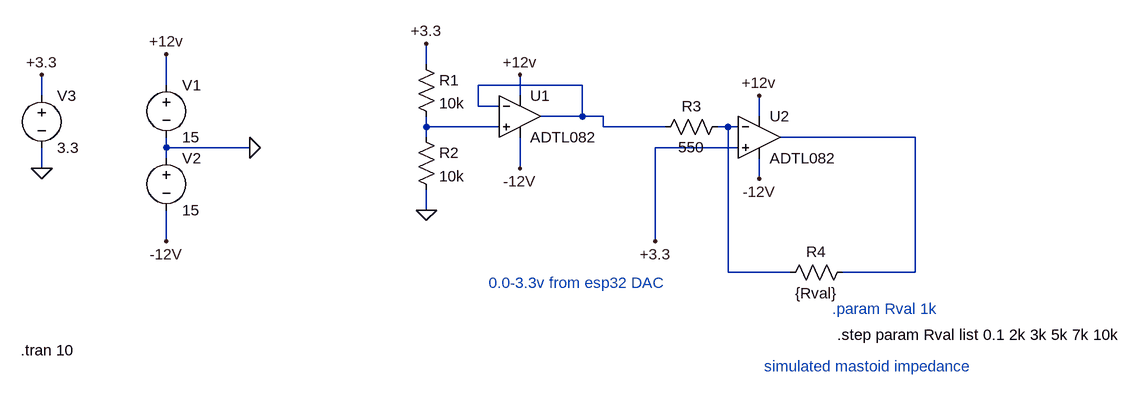
[diagram p0: schematic GVS.asc]
GVS.asc, the LTspice schematic file:
Version 4.1
SHEET 1 1416 680
WIRE 304 96 304 64
WIRE -96 128 -96 80
WIRE 544 128 384 128
WIRE -288 144 -288 112
WIRE 448 144 448 112
WIRE 384 160 384 128
WIRE 416 160 384 160
WIRE 544 176 544 128
WIRE 544 176 480 176
WIRE 576 176 544 176
WIRE 816 176 816 144
WIRE 304 192 304 176
WIRE 416 192 304 192
WIRE 576 192 576 176
WIRE 672 192 576 192
WIRE 768 192 752 192
WIRE 784 192 768 192
WIRE 304 208 304 192
WIRE 1056 208 848 208
WIRE -96 224 -96 208
WIRE 32 224 -96 224
WIRE 784 224 656 224
WIRE -96 240 -96 224
WIRE -288 256 -288 224
WIRE 448 256 448 208
WIRE 816 272 816 240
WIRE 304 320 304 288
WIRE -96 368 -96 320
WIRE 656 368 656 224
WIRE 768 416 768 192
WIRE 864 416 768 416
WIRE 1056 416 1056 208
WIRE 1056 416 944 416
FLAG -96 80 +12v
FLAG -96 368 -12V
FLAG 448 256 -12V
FLAG 448 112 +12v
FLAG -288 112 +3.3
FLAG 816 144 +12v
FLAG 816 272 -12V
FLAG 304 320 0
FLAG 32 224 0
FLAG -288 256 0
FLAG 304 64 +3.3
FLAG 656 368 +3.3
SYMBOL OpAmps\\ADTL082 448 112 R0
SYMATTR InstName U1
SYMBOL OpAmps\\ADTL082 816 144 R0
SYMATTR InstName U2
SYMBOL voltage -96 112 R0
WINDOW 123 0 0 Left 0
WINDOW 39 0 0 Left 0
SYMATTR InstName V1
SYMATTR Value 15
SYMBOL voltage -96 224 R0
WINDOW 123 0 0 Left 0
WINDOW 39 0 0 Left 0
SYMATTR InstName V2
SYMATTR Value 15
SYMBOL voltage -288 128 R0
WINDOW 123 0 0 Left 0
WINDOW 39 0 0 Left 0
SYMATTR InstName V3
SYMATTR Value 3.3
SYMBOL res 288 80 R0
SYMATTR InstName R1
SYMATTR Value 10k
SYMBOL res 288 192 R0
SYMATTR InstName R2
SYMATTR Value 10k
SYMBOL res 768 176 R90
WINDOW 0 0 56 VBottom 2
WINDOW 3 32 56 VTop 2
SYMATTR InstName R3
SYMATTR Value 550
SYMBOL res 960 400 R90
WINDOW 0 0 56 VBottom 2
WINDOW 3 32 56 VTop 2
SYMATTR InstName R4
SYMATTR Value {Rval}
TEXT 928 472 Left 2 ;.param Rval 1k
TEXT 936 512 Left 2 !.step param Rval list 0.1 2k 3k 5k 7k 10k
TEXT -320 536 Left 2 !.tran 10
TEXT 400 432 Left 2 ;0.0-3.3v from esp32 DAC
TEXT 824 560 Left 2 ;simulated mastoid impedance

The netlist it stands for:
* GVS.asc
X§U1 N002 N001 +12v -12V N001 ADTL082  ; pins In+ In- V+ V- OUT
X§U2 +3.3 N003 +12v -12V N004 ADTL082  ; pins In+ In- V+ V- OUT
V1 +12v 0 15
V2 0 -12V 15
V3 +3.3 0 3.3
R1 +3.3 N002 10k
R2 N002 0 10k
R3 N003 N001 550
R4 N004 N003 {Rval}
* .param Rval 1k
.step param Rval list 0.1 2k 3k 5k 7k 10k
.tran 10
* 0.0-3.3v from esp32 DAC
* simulated mastoid impedance
.lib ADI.lib
.backanno
.end